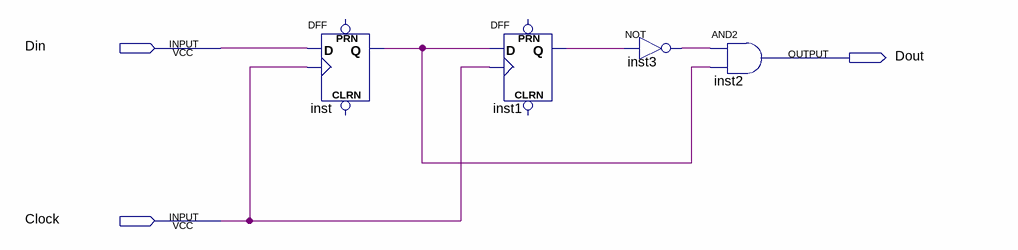
[diagram p0: schematic sheet]
// Quartus schematic TF_Moore.bdf as structural Verilog: 4 symbols, 3 pins
module TF_Moore (
  input  Din,
  input  Clock,
  output Dout
);

  wire inst1_q, inst3_out, inst_q;

  DFF inst (.CLK(Clock), .D(Din), .Q(inst_q));  // open: CLRN, PRN
  DFF inst1 (.CLK(Clock), .D(inst_q), .Q(inst1_q));  // open: CLRN, PRN
  not inst3 (inst3_out, inst1_q);
  and inst2 (Dout, inst3_out, inst_q);
endmodule
